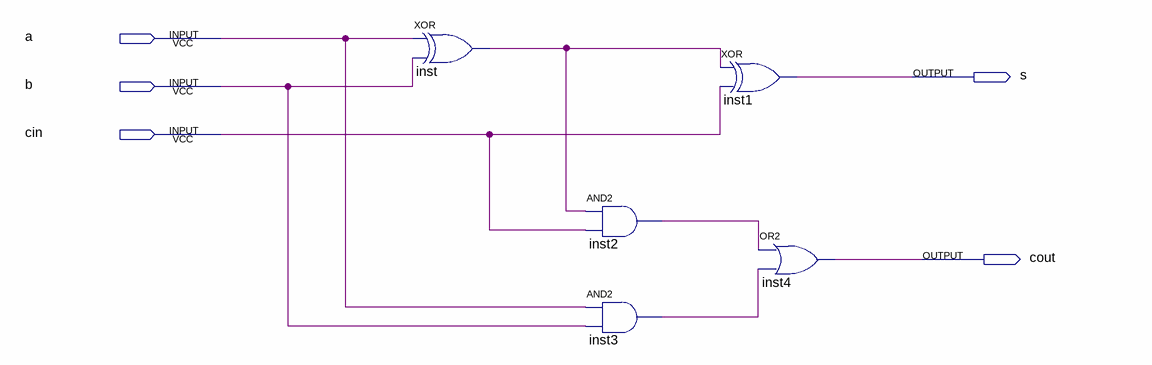
[diagram p0: schematic sheet]
// Quartus schematic FA.bdf as structural Verilog: 5 symbols, 5 pins
module FA (
  input  a,
  input  b,
  input  cin,
  output s,
  output cout
);

  wire inst2_out, inst3_out, inst_out;

  xor inst (inst_out, a, b);
  and inst2 (inst2_out, inst_out, cin);
  and inst3 (inst3_out, a, b);
  xor inst1 (s, inst_out, cin);
  or inst4 (cout, inst2_out, inst3_out);
endmodule
